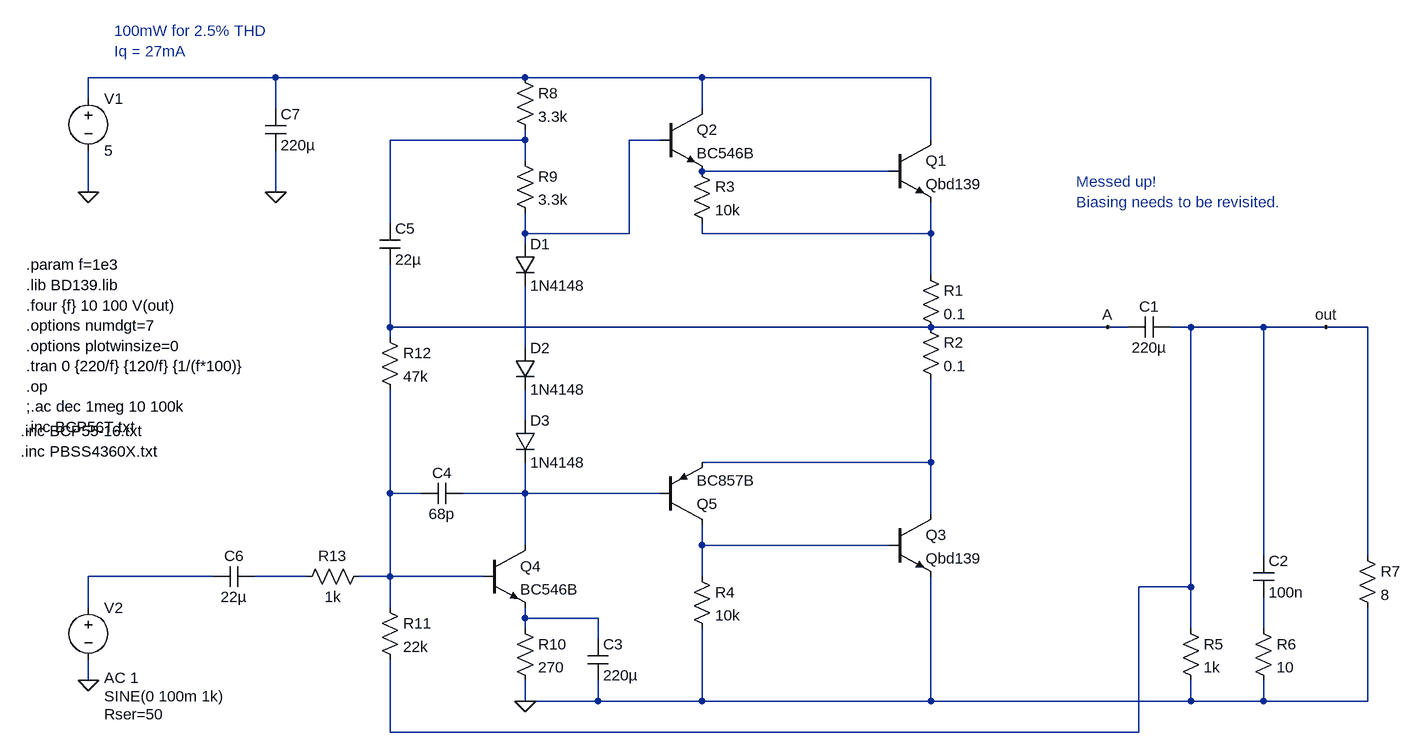
[diagram p0: schematic sound-au_project178_5V.asc]
sound-au_project178_5V.asc, the LTspice schematic file:
Version 4
SHEET 1 880 680
WIRE -1392 -560 -1680 -560
WIRE -1008 -560 -1392 -560
WIRE -736 -560 -1008 -560
WIRE -384 -560 -736 -560
WIRE -1680 -528 -1680 -560
WIRE -1392 -512 -1392 -560
WIRE -736 -512 -736 -560
WIRE -1008 -464 -1008 -480
WIRE -1008 -464 -1216 -464
WIRE -800 -464 -848 -464
WIRE -384 -464 -384 -560
WIRE -1008 -432 -1008 -464
WIRE -448 -416 -736 -416
WIRE -1680 -384 -1680 -448
WIRE -1392 -384 -1392 -448
WIRE -1216 -336 -1216 -464
WIRE -1008 -320 -1008 -352
WIRE -848 -320 -848 -464
WIRE -848 -320 -1008 -320
WIRE -736 -320 -736 -336
WIRE -384 -320 -384 -368
WIRE -384 -320 -736 -320
WIRE -1008 -304 -1008 -320
WIRE -384 -256 -384 -320
WIRE -1216 -176 -1216 -272
WIRE -384 -176 -1216 -176
WIRE -112 -176 -384 -176
WIRE -80 -176 -112 -176
WIRE 16 -176 -16 -176
WIRE 128 -176 16 -176
WIRE 224 -176 128 -176
WIRE 288 -176 224 -176
WIRE -1216 -160 -1216 -176
WIRE -1008 -144 -1008 -240
WIRE -1008 -32 -1008 -80
WIRE -384 32 -384 -96
WIRE -384 32 -736 32
WIRE -1216 80 -1216 -80
WIRE -1168 80 -1216 80
WIRE -1008 80 -1008 32
WIRE -1008 80 -1104 80
WIRE -800 80 -1008 80
WIRE -384 112 -384 32
WIRE -1008 160 -1008 80
WIRE -736 160 -736 128
WIRE -448 160 -736 160
WIRE 128 176 128 -176
WIRE 288 176 288 -176
WIRE -1488 208 -1680 208
WIRE -1344 208 -1424 208
WIRE -1216 208 -1216 80
WIRE -1216 208 -1264 208
WIRE -1072 208 -1216 208
WIRE -736 208 -736 160
WIRE 16 224 16 -176
WIRE 16 224 -64 224
WIRE -1680 256 -1680 208
WIRE -1216 256 -1216 208
WIRE -1008 272 -1008 256
WIRE -896 272 -1008 272
WIRE -1008 288 -1008 272
WIRE 16 288 16 224
WIRE 128 288 128 240
WIRE -896 304 -896 272
WIRE -1680 368 -1680 336
WIRE -1008 400 -1008 368
WIRE -896 400 -896 368
WIRE -896 400 -1008 400
WIRE -736 400 -736 288
WIRE -736 400 -896 400
WIRE -384 400 -384 208
WIRE -384 400 -736 400
WIRE 16 400 16 368
WIRE 16 400 -384 400
WIRE 128 400 128 368
WIRE 128 400 16 400
WIRE 288 400 288 256
WIRE 288 400 128 400
WIRE -1216 448 -1216 336
WIRE -64 448 -64 224
WIRE -64 448 -1216 448
FLAG -1680 368 0
FLAG -1680 -384 0
FLAG -112 -176 A
FLAG -1008 400 0
FLAG 224 -176 out
FLAG -1392 -384 0
DATAFLAG -224 -176 ""
DATAFLAG -912 -320 ""
DATAFLAG -512 -416 ""
DATAFLAG -864 80 ""
DATAFLAG -592 160 ""
DATAFLAG -1136 208 ""
DATAFLAG -896 272 ""
SYMBOL npn -800 -512 R0
SYMATTR InstName Q2
SYMATTR Value BC546B
SYMBOL npn -1072 160 R0
SYMATTR InstName Q4
SYMATTR Value BC546B
SYMBOL pnp -800 128 M180
SYMATTR InstName Q5
SYMATTR Value BC857B
SYMBOL res -400 -272 R0
SYMATTR InstName R1
SYMATTR Value 0.1
SYMBOL res -400 -192 R0
SYMATTR InstName R2
SYMATTR Value 0.1
SYMBOL res -752 -432 R0
SYMATTR InstName R3
SYMATTR Value 10k
SYMBOL res -752 192 R0
SYMATTR InstName R4
SYMATTR Value 10k
SYMBOL cap -16 -192 R90
WINDOW 0 0 32 VBottom 2
WINDOW 3 32 32 VTop 2
SYMATTR InstName C1
SYMATTR Value 220µ
SYMBOL res 0 272 R0
SYMATTR InstName R5
SYMATTR Value 1k
SYMBOL res 112 272 R0
SYMATTR InstName R6
SYMATTR Value 10
SYMBOL cap 112 176 R0
SYMATTR InstName C2
SYMATTR Value 100n
SYMBOL res 272 160 R0
SYMATTR InstName R7
SYMATTR Value 8
SYMBOL res -1024 -576 R0
SYMATTR InstName R8
SYMATTR Value 3.3k
SYMBOL res -1024 -448 R0
SYMATTR InstName R9
SYMATTR Value 3.3k
SYMBOL res -1024 272 R0
SYMATTR InstName R10
SYMATTR Value 270
SYMBOL cap -912 304 R0
SYMATTR InstName C3
SYMATTR Value 220µ
SYMBOL cap -1104 64 R90
WINDOW 0 0 32 VBottom 2
WINDOW 3 32 32 VTop 2
SYMATTR InstName C4
SYMATTR Value 68p
SYMBOL res -1232 240 R0
SYMATTR InstName R11
SYMATTR Value 22k
SYMBOL res -1232 -176 R0
SYMATTR InstName R12
SYMATTR Value 47k
SYMBOL cap -1232 -336 R0
SYMATTR InstName C5
SYMATTR Value 22µ
SYMBOL res -1248 192 R90
WINDOW 0 0 56 VBottom 2
WINDOW 3 32 56 VTop 2
SYMATTR InstName R13
SYMATTR Value 1k
SYMBOL cap -1424 192 R90
WINDOW 0 0 32 VBottom 2
WINDOW 3 32 32 VTop 2
SYMATTR InstName C6
SYMATTR Value 22µ
SYMBOL voltage -1680 -544 R0
SYMATTR InstName V1
SYMATTR Value 5
SYMBOL voltage -1680 240 R0
WINDOW 3 24 152 Left 2
WINDOW 123 24 124 Left 2
WINDOW 39 24 180 Left 2
SYMATTR Value SINE(0 100m 1k)
SYMATTR Value2 AC 1
SYMATTR SpiceLine Rser=50
SYMATTR InstName V2
SYMBOL cap -1408 -512 R0
SYMATTR InstName C7
SYMATTR Value 220µ
SYMBOL diode -1024 -304 R0
SYMATTR InstName D1
SYMATTR Value 1N4148
SYMBOL diode -1024 -144 R0
SYMATTR InstName D2
SYMATTR Value 1N4148
SYMBOL diode -1024 -32 R0
SYMATTR InstName D3
SYMATTR Value 1N4148
SYMBOL npn -448 -464 R0
SYMATTR InstName Q1
SYMATTR Value Qbd139
SYMBOL npn -448 112 R0
SYMATTR InstName Q3
SYMATTR Value Qbd139
TEXT -1776 -272 Left 2 !.param f=1e3\n.lib BD139.lib\n.four {f} 10 100 V(out)\n.options numdgt=7\n.options plotwinsize=0\n.tran 0 {220/f} {120/f} {1/(f*100)}\n.op\n;.ac dec 1meg 10 100k\n.inc BCP56T.txt
TEXT -1640 -632 Left 2 ;100mW for 2.5% THD\nIq = 27mA
TEXT -1784 -16 Left 2 !.inc BCP55-16.txt\n.inc PBSS4360X.txt
TEXT -160 -400 Left 2 ;Messed up!\nBiasing needs to be revisited.

The netlist it stands for:
* sound-au_project178_5V.asc
Q2 N001 N003 N004 0 BC546B
Q4 N010 N009 N014 0 BC546B
Q5 N011 N010 N008 0 BC857B
R1 N005 A 0.1
R2 A N008 0.1
R3 N004 N005 10k
R4 N011 0 10k
C1 out A 220µ
R5 out 0 1k
R6 N015 0 10
C2 out N015 100n
R7 out 0 8
R8 N001 N002 3.3k
R9 N002 N003 3.3k
R10 N014 0 270
C3 N014 0 220µ
C4 N010 N009 68p
R11 N009 out 22k
R12 A N009 47k
C5 N002 A 22µ
R13 N009 N013 1k
C6 N013 N012 22µ
V1 N001 0 5
V2 N012 0 SINE(0 100m 1k) AC 1 Rser=50
C7 N001 0 220µ
D1 N003 N006 1N4148
D2 N006 N007 1N4148
D3 N007 N010 1N4148
Q1 N001 N004 N005 0 Qbd139
Q3 N008 N011 0 0 Qbd139
.model D D
.lib standard.dio
.model NPN NPN
.model PNP PNP
.lib standard.bjt
.param f=1e3
.lib BD139.lib
.four {f} 10 100 V(out)
.options numdgt=7
.options plotwinsize=0
.tran 0 {220/f} {120/f} {1/(f*100)}
.op
;.ac dec 1meg 10 100k
.inc BCP56T.txt
* 100mW for 2.5% THD
* Iq = 27mA
.inc BCP55-16.txt
.inc PBSS4360X.txt
* Messed up!
* Biasing needs to be revisited.
.backanno
.end